# EAGLE design odsprzeganie_zasilania (EAGLE 4.13)
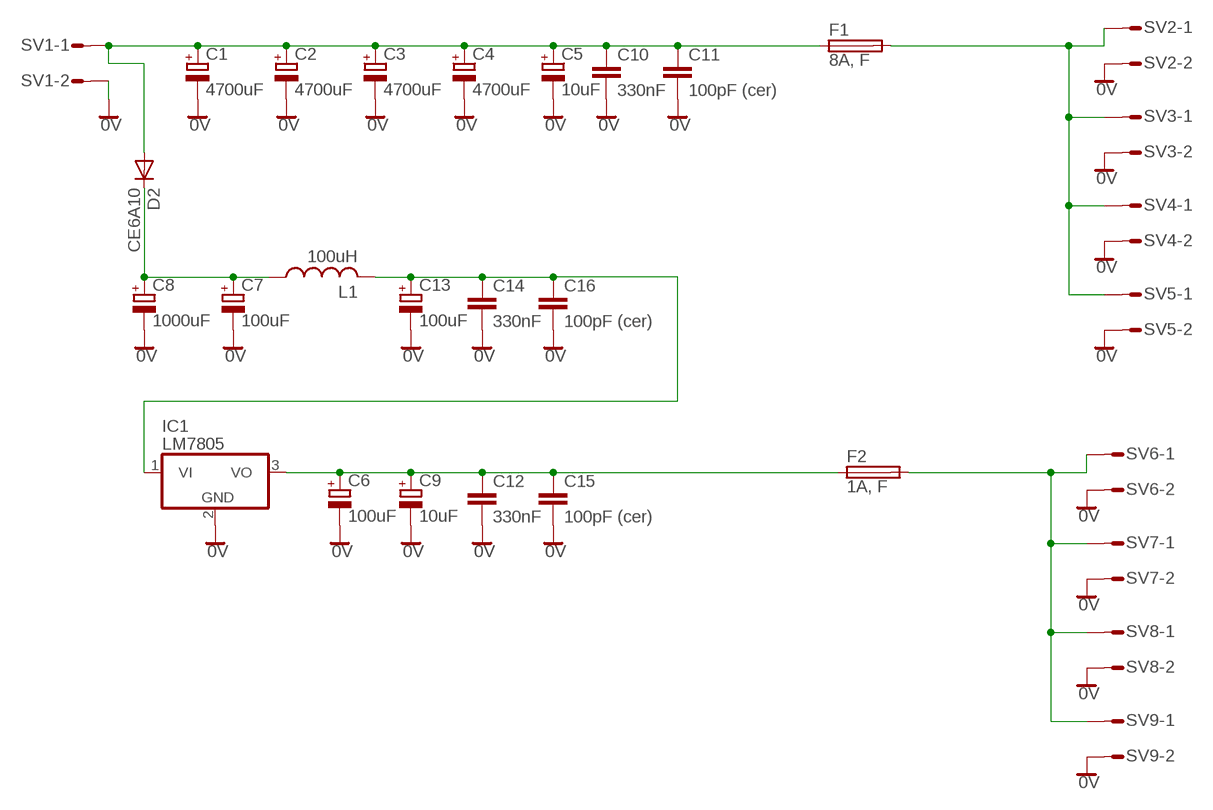
[diagram p0: schematic, sheet 1]

## Parts
C1  4700uF  CPOL-EUE7.5-16  [E7,5-16]
C2  4700uF  CPOL-EUE7.5-16  [E7,5-16]
C3  4700uF  CPOL-EUE7.5-16  [E7,5-16]
C4  4700uF  CPOL-EUE7.5-16  [E7,5-16]
C5  10uF  CPOL-EUE2.5-6  [E2,5-6]
C6  100uF  CPOL-EUE2.5-7  [E2,5-7]
C7  100uF  CPOL-EUE2.5-7  [E2,5-7]
C8  1000uF  CPOL-EUE7.5-16  [E7,5-16]
C9  10uF  CPOL-EUE2.5-6  [E2,5-6]
C10  330nF  C-EU050-030X075  [C050-030X075]
C11  100pF (cer)  C-EU050-030X075  [C050-030X075]
C12  330nF  C-EU050-030X075  [C050-030X075]
C13  100uF  CPOL-EUE2.5-7  [E2,5-7]
C14  330nF  C-EU050-030X075  [C050-030X075]
C15  100pF (cer)  C-EU050-030X075  [C050-030X075]
C16  100pF (cer)  C-EU050-030X075  [C050-030X075]
D2  CE6A10  BA296  [P2-15]
F1  8A, F  SH22  [SH22]
F2  1A, F  SH22  [SH22]
IC1  LM7805  7805T  [TO220H]
L1  100uH  L-US0207/10  [0207/10]
SV1  L02P  [L02P]
SV2  L02P  [L02P]
SV3  L02P  [L02P]
SV4  L02P  [L02P]
SV5  L02P  [L02P]
SV6  L02P  [L02P]
SV7  L02P  [L02P]
SV8  L02P  [L02P]
SV9  L02P  [L02P]

## Nets
0V: C1.- C2.- C3.- C4.- C5.- C6.- C7.- C8.- C9.- C10.2 C11.2 C12.2 C13.- C14.2 C15.2 C16.2 IC1.2(GND) SV1.2 SV2.2 SV3.2 SV4.2 SV5.2 SV6.2 SV7.2 SV8.2 SV9.2
N$1: C1.+ C2.+ C3.+ C4.+ C5.+ C10.1 C11.1 D2.A F1.1 SV1.1
N$2: F1.2 SV2.1 SV3.1 SV4.1 SV5.1
N$3: C7.+ C8.+ D2.C L1.1
N$4: C13.+ C14.1 C16.1 IC1.1(VI) L1.2
N$5: F2.2 SV6.1 SV7.1 SV8.1 SV9.1
N$6: C6.+ C9.+ C12.1 C15.1 F2.1 IC1.3(VO)

## Library data of the parts
C1-C9 C13 = rcl:CPOL-EU: POLARIZED CAPACITOR, European symbol
C10-C12 C14-C16 = rcl:C-EU: CAPACITOR, European symbol
D2 = diode:BA296: DIODE
F1 F2 = fuse:SH22: FUSE HOLDER CS PFP30, Schukat
IC1 = linear:78*: Positive VOLTAGE REGULATOR
L1 = rcl:L-US: INDUCTOR, American symbol
SV1-SV9 = con-amp-mt:L02P: AMP MT CONNECTOR

## Board
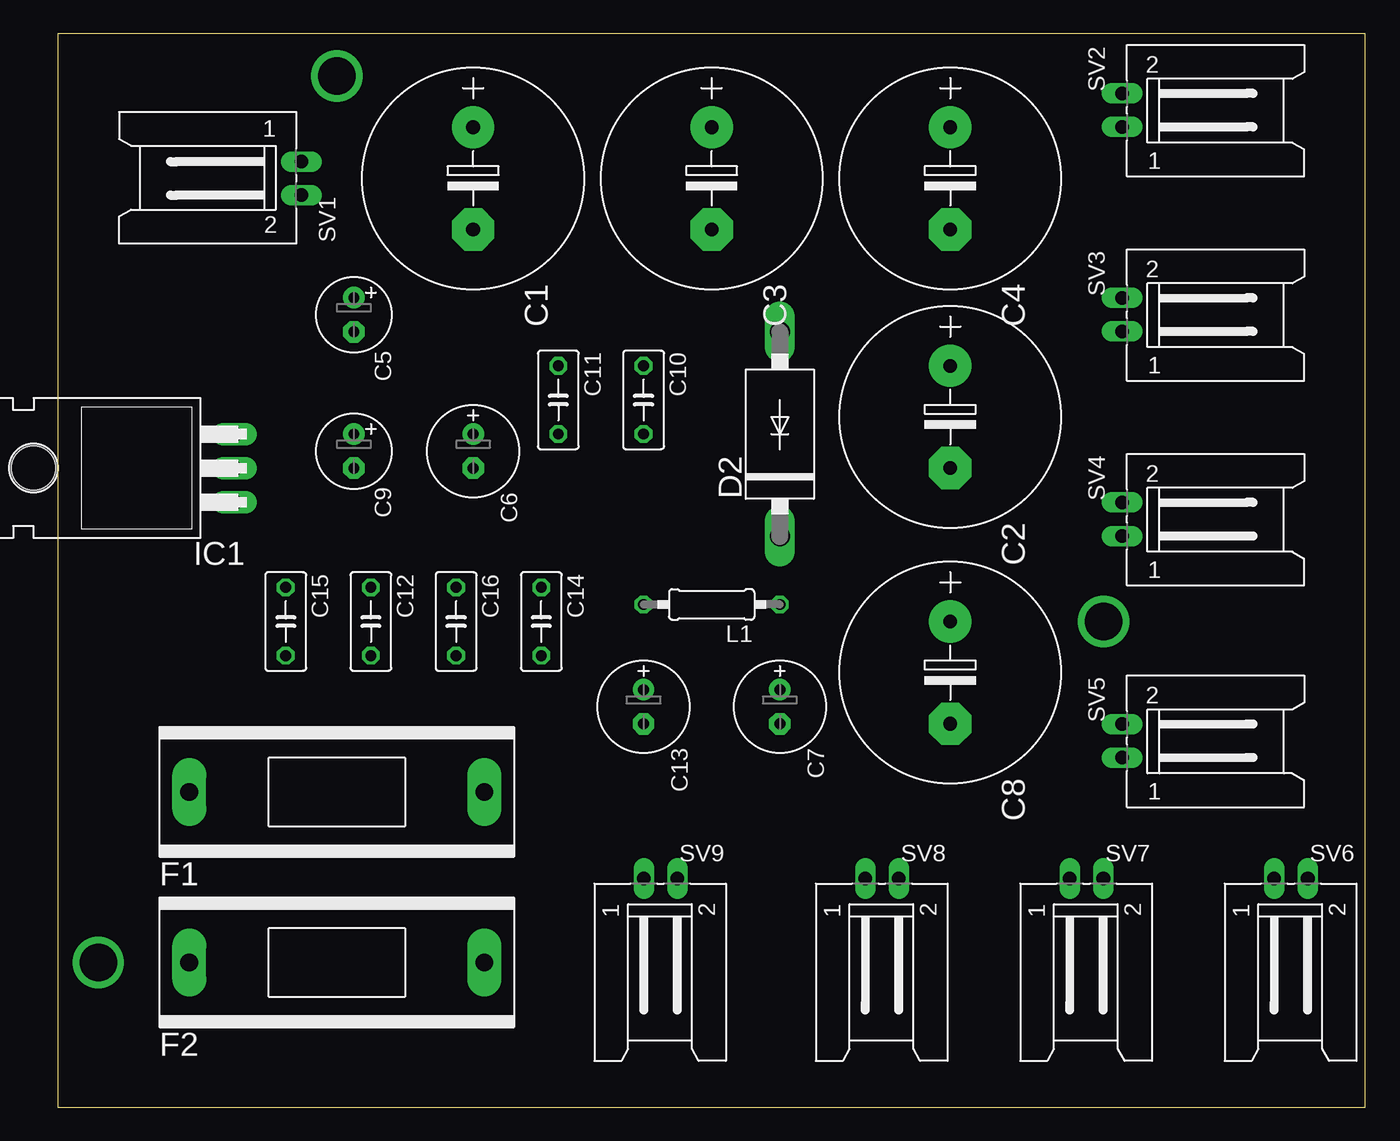
[diagram p1: board, top side]
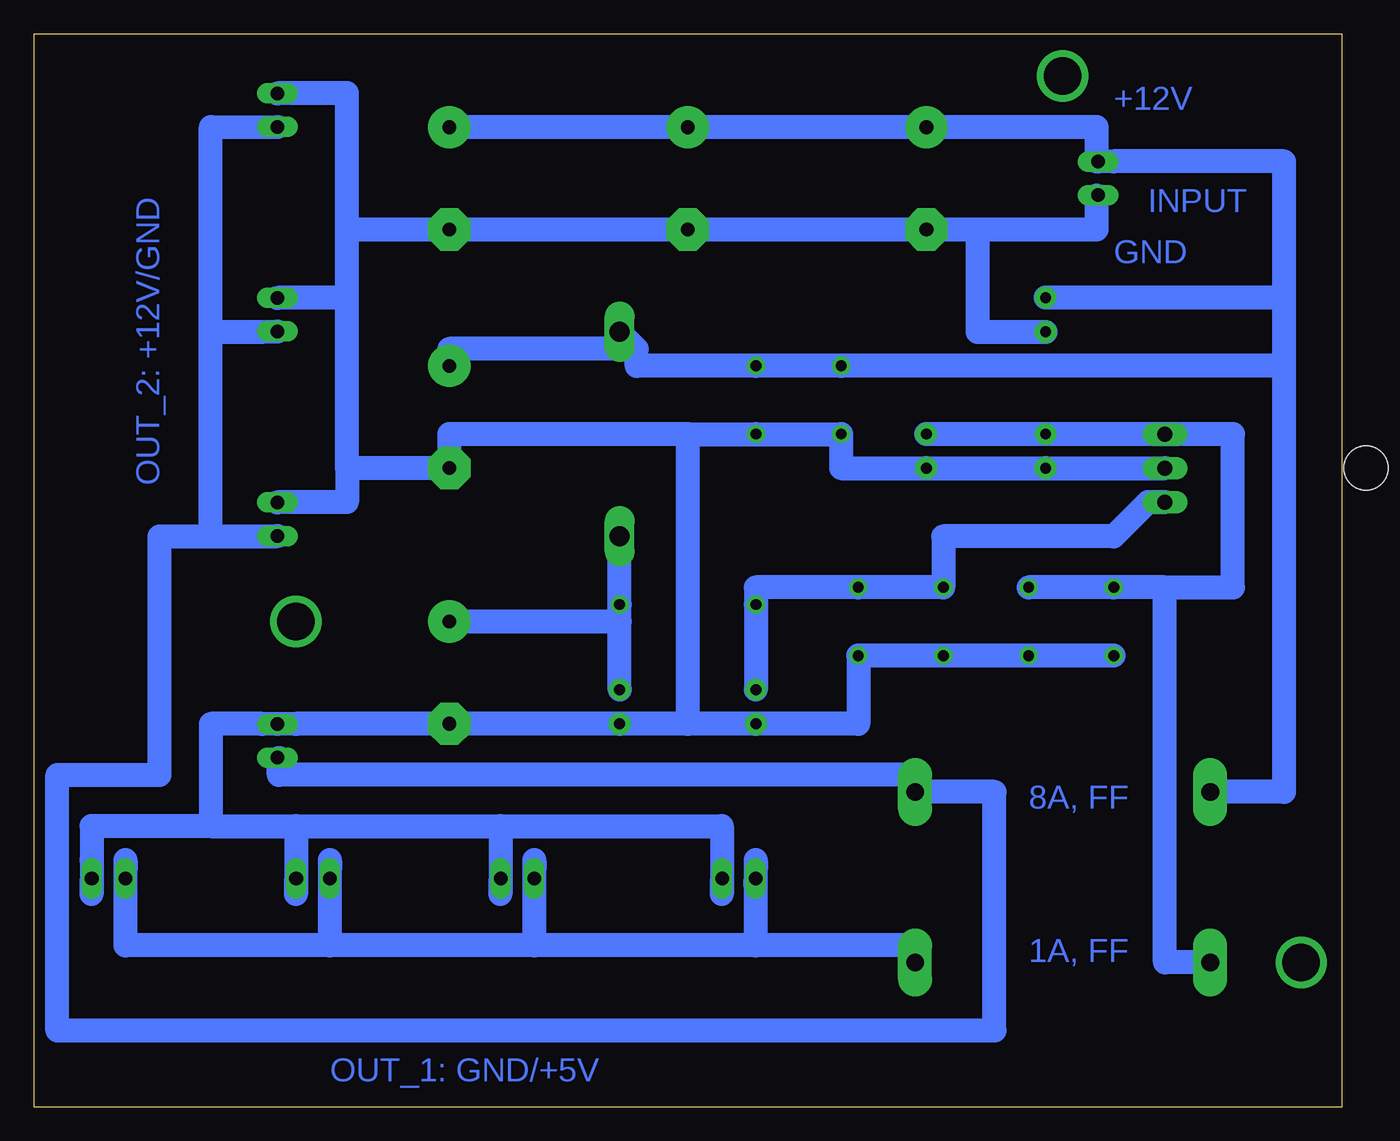
[diagram p2: board, bottom side, seen from below]

Size 97.46 x 80 mm. Coordinates in mm from the lower left corner, seen from the top.
Outline: 0,0 97.46,0 97.46,80 0,80 0,0
Copper layers (1*16): Top 0.035mm / dielectric 1.5mm / Bottom 0.035mm
Design rules "default": minimum track width 10mil, minimum drill 24mil, track to track 8mil, track to pad 8mil, pad to pad 8mil, via to via 8mil, smd to smd 8mil, copper to edge 40mil, drill to drill 8mil, minimum pad ring 10mil, minimum via ring 8mil, stop-mask expansion 4mil, vias tented up to drill 0mil, thermal gap 10mil

### Footprints (pad centres in the part's own frame; a part is rotated, then mirrored left to right if it is on the bottom)
E7,5-16 = drill 1.016 pad 3.15 round: + -3.81,0 | drill 1.016 pad 3.15 octagon: - 3.81,0
E2,5-6 = drill 0.813 pad 1.6 round: + -1.27,0 | drill 0.813 pad 1.6 octagon: - 1.27,0
E2,5-7 = drill 0.813 pad 1.6 round: + -1.27,0 | drill 0.813 pad 1.6 octagon: - 1.27,0
C050-030X075 = drill 0.813 octagon: 1 -2.54,0; 2 2.54,0
P2-15 = drill 1.499 long: A 7.62,0; C -7.62,0
SH22 = drill 1.321 pad 2.54 long: 1 -10.998,0; 2 10.998,0
TO220H = drill 1.118 long: 1 -2.54,-10.16; 2 0,-10.16; 3 2.54,-10.16 | hole 3.302: 0,4.826
0207/10 = drill 0.813 octagon: 1 -5.08,0; 2 5.08,0
L02P = drill 1.016 long: 1 1.25,-6.25; 2 -1.25,-6.25

### Placement (x,y rotation side)
C1  30.95,69.21 270 top
C2  66.51,51.43 270 top
C3  48.73,69.21 270 top
C4  66.51,69.21 270 top
C5  22.06,59.05 270 top
C6  30.95,48.89 270 top
C7  53.81,29.84 270 top
C8  66.51,32.38 270 top
C9  22.06,48.89 270 top
C10  43.65,52.7 270 top
C11  37.3,52.7 270 top
C12  23.33,36.19 270 top
C13  43.65,29.84 270 top
C14  36.03,36.19 270 top
C15  16.98,36.19 270 top
C16  29.68,36.19 270 top
D2  53.81,50.16 90 top
F1  20.79,23.49 0 top
F2  20.79,10.79 0 top
IC1  3.01,47.62 90 top
L1  48.73,37.46 180 top
SV1  11.9,69.21 90 top
SV2  85.56,74.29 270 top
SV3  85.56,59.05 270 top
SV4  85.56,43.81 270 top
SV5  85.56,27.3 270 top
SV6  91.91,10.79 180 top
SV7  76.67,10.79 180 top
SV8  61.43,10.79 180 top
SV9  44.92,10.79 180 top

### Tracks (layer width: path | path; a pad name or v marks a point on that pad's centre or on a via)
0V
  Bottom 0.254: 18.25,67.94 SV1.2 | 27.14,65.4 29.68,65.4 C1.-
  Bottom 1.778: 62.7,20.95 46.19,20.95 46.19,15.87 SV9.2 | 62.7,20.95 62.7,15.87 SV8.2 | 77.94,20.95 77.94,15.87 SV7.2 | 77.94,20.95 62.7,20.95 | 93.18,20.95 93.18,15.87 SV6.2 93.18,18.41 93.18,20.95 | 84.29,20.95 77.94,20.95 | C15.2 C12.2 C16.2 C14.2 36.03,28.57 C13.- 48.73,28.57 | 84.29,20.95 84.29,28.57 80.48,28.57 SV5.2 77.94,28.57 C8.- C7.- 48.73,28.57 | 84.29,20.95 93.18,20.95 | IC1.2 C9.- C6.- 37.3,47.62 C11.2 C10.2 48.73,50.16 | 18.25,67.94 18.25,65.4 29.68,65.4 | 27.14,65.4 27.14,57.78 C5.- | 74.13,47.62 74.13,45.08 77.94,45.08 SV4.2 | 74.13,47.62 C2.- 66.51,50.16 48.73,50.16 | 74.13,60.32 74.13,65.4 | 74.13,60.32 77.94,60.32 SV3.2 | 74.13,65.4 74.13,75.56 SV2.2 | 74.13,65.4 C4.- C3.- C1.- | 74.13,47.62 74.13,60.32 | 48.73,28.57 48.73,50.16
N$1
  Bottom 0.254: SV1.1 18.25,70.48
  Bottom 1.778: C4.+ C3.+ C1.+ 18.25,73.02 18.25,70.48 | 4.28,60.32 C5.+ | 4.28,60.32 4.28,70.48 16.98,70.48 SV1.1 | 4.28,55.24 4.28,60.32 | 4.28,55.24 4.28,23.49 F1.1 | 4.28,55.24 C11.1 C10.1 52.54,55.24 52.54,56.51 | C2.+ 66.51,56.51 52.54,56.51 | 52.54,56.51 D2.A
N$2
  Bottom 0.254: 79.21,26.03 SV5.1
  Bottom 1.778: 84.29,42.54 84.29,57.78 | 84.29,57.78 80.48,57.78 SV3.1 | 84.29,57.78 84.29,73.02 SV2.1 | 79.21,26.03 79.21,24.76 32.22,24.76 F1.2 25.87,23.49 25.87,5.71 95.72,5.71 95.72,24.76 88.1,24.76 88.1,42.54 84.29,42.54 | 84.29,42.54 80.48,42.54 SV4.1
N$3
  Bottom 1.778: 53.81,36.19 L1.1 D2.C | C7.+ 53.81,36.19 | 53.81,36.19 C8.+
N$4
  Bottom 1.778: C13.+ L1.2 43.65,38.73 C14.1 C16.1 29.68,42.54 16.98,42.54 14.44,45.08 IC1.1
N$5
  Bottom 1.778: 43.65,12.06 43.65,15.87 SV9.1 43.65,18.41 43.65,12.06 | 43.65,12.06 32.22,12.06 F2.2 | 60.16,12.06 60.16,18.41 SV8.1 | 60.16,12.06 75.4,12.06 | 75.4,12.06 75.4,18.41 SV7.1 | 75.4,12.06 90.64,12.06 90.64,18.41 SV6.1 | 43.65,12.06 60.16,12.06
N$6
  Bottom 1.778: C6.+ C9.+ IC1.3 8.09,50.16 8.09,38.73 13.17,38.73 | C12.1 C15.1 13.17,38.73 | 13.17,38.73 13.17,10.79 F2.1
N$7  (via drill 2.8)
  other vias: 3.01,10.79
N$8  (via drill 2.8)
  other vias: 20.79,76.83
N$9  (via drill 2.8)
  other vias: 77.94,36.19

### Text on the board
Bottom: +12V | INPUT | GND | OUT_2: +12V/GND | 8A, FF | 1A, FF | OUT_1: GND/+5V